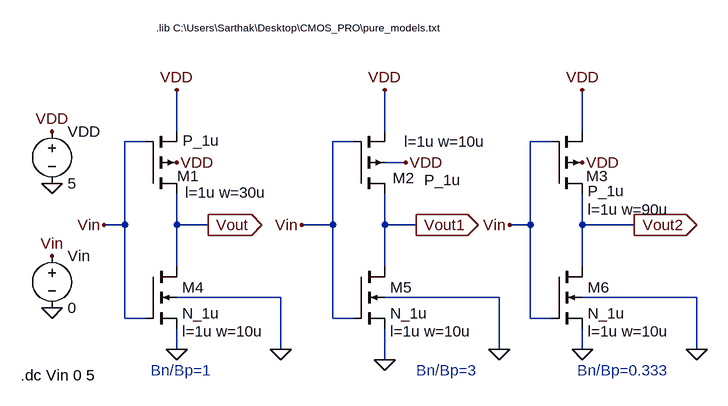
[diagram p0: schematic lab3a.asc]
lab3a.asc, the LTspice schematic file:
Version 4
SHEET 1 880 680
WIRE -96 176 -96 112
WIRE 224 176 224 112
WIRE 528 176 528 112
WIRE -144 192 -176 192
WIRE 176 192 144 192
WIRE 480 192 448 192
WIRE 256 224 224 224
WIRE -176 320 -176 192
WIRE -176 320 -208 320
WIRE -96 320 -96 272
WIRE -48 320 -96 320
WIRE 144 320 144 192
WIRE 144 320 96 320
WIRE 224 320 224 272
WIRE 272 320 224 320
WIRE 448 320 448 192
WIRE 448 320 416 320
WIRE 528 320 528 272
WIRE 608 320 528 320
WIRE -96 384 -96 320
WIRE 224 384 224 320
WIRE 528 384 528 320
WIRE 64 432 -96 432
WIRE 400 432 224 432
WIRE 704 432 528 432
WIRE -176 464 -176 320
WIRE -144 464 -176 464
WIRE 144 464 144 320
WIRE 176 464 144 464
WIRE 448 464 448 320
WIRE 480 464 448 464
WIRE -96 512 -96 480
WIRE 64 512 64 432
WIRE 400 512 400 432
WIRE 528 512 528 480
WIRE 704 512 704 432
WIRE 224 528 224 480
FLAG 224 528 0
FLAG -96 512 0
FLAG 64 512 0
FLAG 400 512 0
FLAG 528 512 0
FLAG 704 512 0
FLAG -288 256 0
FLAG -288 448 0
FLAG -288 368 Vin
FLAG -208 320 Vin
FLAG 96 320 Vin
FLAG 416 320 Vin
FLAG -96 112 VDD
FLAG 224 112 VDD
FLAG 528 112 VDD
FLAG -96 224 VDD
FLAG 528 224 VDD
FLAG 256 224 VDD
FLAG -288 176 VDD
FLAG -48 320 Vout
IOPIN -48 320 Out
FLAG 272 320 Vout1
IOPIN 272 320 Out
FLAG 608 320 Vout2
IOPIN 608 320 Out
SYMBOL pmos4 -144 272 M180
WINDOW 0 49 27 Left 2
WINDOW 3 85 66 Top 2
WINDOW 123 124 -14 Top 2
SYMATTR InstName M1
SYMATTR Value P_1u
SYMATTR Value2 l=1u w=30u
SYMBOL pmos4 480 272 M180
WINDOW 3 56 4 Left 2
WINDOW 123 56 -24 Left 2
WINDOW 0 54 27 Left 2
SYMATTR Value P_1u
SYMATTR Value2 l=1u w=90u
SYMATTR InstName M3
SYMBOL nmos4 -144 384 R0
WINDOW 123 56 100 Left 2
SYMATTR Value2 l=1u w=10u
SYMATTR InstName M4
SYMATTR Value N_1u
SYMBOL nmos4 176 384 R0
WINDOW 123 56 100 Left 2
SYMATTR Value2 l=1u w=10u
SYMATTR InstName M5
SYMATTR Value N_1u
SYMBOL nmos4 480 384 R0
WINDOW 123 56 100 Left 2
SYMATTR Value2 l=1u w=10u
SYMATTR InstName M6
SYMATTR Value N_1u
SYMBOL voltage -288 352 R0
WINDOW 123 0 0 Left 0
WINDOW 39 0 0 Left 0
SYMATTR InstName Vin
SYMATTR Value 0
SYMBOL pmos4 176 272 M180
WINDOW 3 109 21 Left 2
WINDOW 123 78 80 Left 2
WINDOW 0 60 24 Left 2
SYMATTR Value P_1u
SYMATTR Value2 l=1u w=10u
SYMATTR InstName M2
SYMBOL voltage -288 160 R0
WINDOW 123 0 0 Left 0
WINDOW 39 0 0 Left 0
SYMATTR InstName VDD
SYMATTR Value 5
TEXT -128 16 Left 1 !.lib C:\\Users\\Sarthak\\Desktop\\CMOS_PRO\\pure_models.txt
TEXT -336 552 Left 2 !.dc Vin 0 5
TEXT -136 544 Left 2 ;Bn/Bp=1
TEXT 272 544 Left 2 ;Bn/Bp=3
TEXT 520 544 Left 2 ;Bn/Bp=0.333

The netlist it stands for:
* lab3a.asc
M1 Vout Vin VDD VDD P_1u l=1u w=30u
M3 Vout2 Vin VDD VDD P_1u l=1u w=90u
M4 Vout Vin 0 0 N_1u l=1u w=10u
M5 Vout1 Vin 0 0 N_1u l=1u w=10u
M6 Vout2 Vin 0 0 N_1u l=1u w=10u
Vin Vin 0 0
M2 Vout1 Vin VDD VDD P_1u l=1u w=10u
VDD VDD 0 5
.model NMOS NMOS
.model PMOS PMOS
.lib standard.mos
.lib C:\Users\Sarthak\Desktop\CMOS_PRO\pure_models.txt
.dc Vin 0 5
* Bn/Bp=1
* Bn/Bp=3
* Bn/Bp=0.333
.backanno
.end